# Altium project TS-IC EMC1833T.PrjPcb
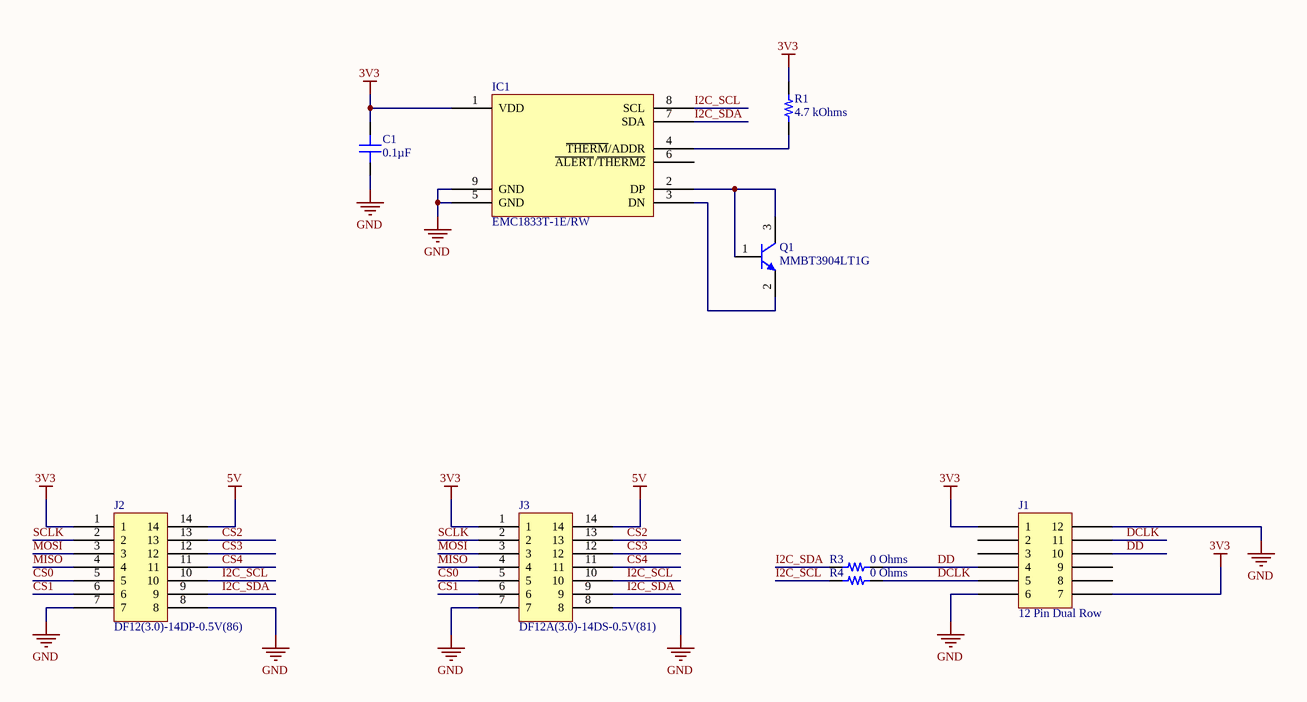
[diagram p0: EMC1833T.SchDoc]
1 sheet, 9 parts. Net scope: global (net labels, ports and power ports of the same name join across sheets).
Board file: EM1833T Card.PcbDoc

## Sheet EMC1833T.SchDoc: Digital Temperature Sensor
size A4

### Parts
C1  0.1µF  [CAP 0603_1608]
IC1  EMC1833T-1E/RW  [MICROCHIP WDFN-8 2x2MM]
J1  12 Pin Dual Row  [TE 5650118-3 Card Edge]
J2  DF12(3.0)-14DP-0.5V(86)  [HIROSE DF12 3.0-14DP-0.5V 86]
J3  DF12A(3.0)-14DS-0.5V(81)  [HIROSE DF12A 3.0-14DS-0.5V 81]
Q1  MMBT3904LT1G  [ON SEMI SOT-23-3]
R1  4.7 kOhms  [RES 0603_1608]
R3  0 Ohms  [RES 0603_1608]
R4  0 Ohms  [RES 0603_1608]

### Nets
3V3: C1.1 IC1.1(VDD) J1.1 J1.7 J2.1 J3.1 R1.2
5V: J2.14 J3.14
GND: C1.2 IC1.5(GND) IC1.9(GND) J1.6 J1.12 J2.7 J2.8 J3.7 J3.8
CS0: J2.5 J3.5
CS1: J2.6 J3.6
CS2: J2.13 J3.13
CS3: J2.12 J3.12
CS4: J2.11 J3.11
DCLK: J1.5 J1.11 R4.2
DD: J1.4 J1.10 R3.2
I2C_SCL: IC1.8(SCL) J2.10 J3.10 R4.1
I2C_SDA: IC1.7(SDA) J2.9 J3.9 R3.1
MISO: J2.4 J3.4
MOSI: J2.3 J3.3
SCLK: J2.2 J3.2
NetIC1_2: IC1.2(DP) Q1.1(B) Q1.3(C)
NetIC1_3: IC1.3(DN) Q1.2(E)
NetIC1_4: IC1.4(~{THERM}/ADDR) R1.1

Not connected (* = marked no-connect by the designer): IC1 6(~{ALERT}/~{THERM2}); J1 2 3 8 9

### Notes on the sheet
- Title
- Size:
- Date:
- A4
- Number:
- Time:
- Revision:
- Sheet
- of
- File:

### Library data of the parts
C1 = CC0603ZRY5V7BB104: CAP CER 0.1UF 16V Y5V 0603; Manufacturer: Yageo; Temperature Coefficient: Y5V (F); Tolerance: -20%, +80%; Part Number: CC0603ZRY5V7BB104; Value: 0.1µF; Applications: General Purpose; Capacitance: 0.1µF; ComponentLink1Description: Datasheet; ComponentLink1URL: http://www.yageo.com/documents/recent/UPY-GPHC_Y5V_6.3V-to-50V_8.pdf; ComponentLink2Description: DigiKey Link; ComponentLink2URL: http://digikey.com/product-detail/en/yageo/CC0603ZRY5V7BB104/311-1369-1-ND/2103153; Device Package: 0603 (1608 Metric); LastUpdated: 21/01/2020 00:01:38; Lifecycle Status: Active; Minimum Order: 1; Mounting Type: Surface Mount, MLCC; Operating Temperature: -30°C ~ 85°C; Package / Case: 0603 (1608 Metric); Packaging: TapeAndReel; PartId: 17881; Part Status: Active; Price: 0.01; Series: CC; Size / Dimension: 0.063" L x 0.031" W (1.60mm x 0.80mm); Supplier 1: DigiKey; Supplier Part Number 1: 311-1369-1-ND; Thickness (Max): 0.035" (0.90mm); Voltage - Rated: 16V
IC1 = EMC1833T-1E/RW: 1.8V 3 CHANNEL TEMP SENSOR I2C 2; Manufacturer: Microchip Technology; Accuracy - Highest (Lowest): ±1.5°C; Output Type: I²C/SMBus; Sensing Temperature - Remote: -40°C ~ 125°C; Sensor Type: Digital, Remote; Voltage - Supply: 1.62V ~ 3.6V; Part Number: EMC1833T-1E/RW; ComponentLink1Description: Datasheet; ComponentLink1URL: http://www.microchip.com/mymicrochip/filehandler.aspx?ddocname=en607782; ComponentLink2Description: DigiKey Link; ComponentLink2URL: http://digikey.com/product-detail/en/microchip-technology/EMC1833T-1E-RW/EMC1833T-1E-RWCT-ND/9657607; Device Package: 8-WDFN Exposed Pad; Features: One-Shot, Programmable Limit, Standby Mode; LastUpdated: 25/05/2020 18:02:53; Lifecycle Status: Active; Minimum Order: 1; Mounting Type: Surface Mount; Operating Temperature: -40°C ~ 125°C; Package / Case: 8-WDFN Exposed Pad; Packaging: TapeAndReel; Part Status: Active; Price: 0.65; Series: -; Supplier 1: DigiKey; Supplier Part Number 1: EMC1833T-1E/RWCT-ND; Supplier Device Package: 8-WDFN (2x2); Test Condition: -40°C ~ 125°C
J2 = DF12(3.0)-14DP-0.5V(86): CONN HDR 14POS SMD GOLD; Manufacturer: Hirose Electric Co Ltd; Connector Type: Header, Outer Shroud Contacts; Mated Stacking Heights: 3mm; Number of Positions: 14; Pitch: 0.020" (0.50mm); Part Number: DF12(3.0)-14DP-0.5V(86); ComponentLink1Description: Datasheet; ComponentLink1URL: https://www.hirose.com/product/download/?distributor=digikey&type=specSheet&lang=en&num=DF12(3.0)-14DP-0.5V(86); ComponentLink2Description: DigiKey Link; ComponentLink2URL: http://digikey.com/product-detail/en/hirose-electric-co-ltd/DF12-3.0-14DP-0.5V-86/H11701CT-ND/2172493; Contact Finish: Gold; Contact Finish Thickness: 8.00µin (0.203µm); Features: Board Guide, Solder Retention; Height Above Board: 0.091" (2.30mm); LastUpdated: 06/08/2020 22:47:47; Lifecycle Status: Active; Minimum Order: 1; Mounting Type: Surface Mount; Number of Rows: 2; Packaging: TapeAndReel; Part Status: Active; Price: 0.38; Series: DF12; Supplier 1: DigiKey; Supplier Part Number 1: H11701CT-ND
J3 = DF12A(3.0)-14DS-0.5V(81): CONN RCPT 14POS SMD GOLD; Manufacturer: Hirose Electric Co Ltd; Connector Type: Receptacle, Center Strip Contacts; Mated Stacking Heights: 3mm; Number of Positions: 14; Pitch: 0.020" (0.50mm); Part Number: DF12A(3.0)-14DS-0.5V(81); ComponentLink1Description: Datasheet; ComponentLink1URL: https://www.hirose.com/product/document?clcode=CL0537-0721-0-86&productname=DF12(3.0)-10DP-0.5V(86)&series=DF12&documenttype=Catalog&lang=en&documentid=D31693_en; ComponentLink2Description: DigiKey Link; ComponentLink2URL: http://digikey.com/product-detail/en/hirose-electric-co-ltd/DF12A-3.0-14DS-0.5V-81/H11713CT-ND/2172505; Contact Finish: Gold; Contact Finish Thickness: 8.00µin (0.203µm); Features: Board Guide; Height Above Board: 0.087" (2.20mm); LastUpdated: 06/08/2020 22:48:47; Lifecycle Status: Active; Minimum Order: 1; Mounting Type: Surface Mount; Number of Rows: 2; Packaging: TapeAndReel; Part Status: Active; Price: 0.36; Series: DF12; Supplier 1: DigiKey; Supplier Part Number 1: H11713CT-ND
Q1 = MMBT3904LT1G: TRANS NPN 40V 0.2A SOT23; Manufacturer: ON Semiconductor; Current - Collector (Ic) (Max): 200mA; DC Current Gain (hFE) (Min) @ Ic, Vce: 100 @ 10mA, 1V; Frequency - Transition: 300MHz; Power - Max: 300mW; Vce Saturation (Max) @ Ib, Ic: 300mV @ 5mA, 50mA; Part Number: MMBT3904LT1G; ComponentLink1Description: Datasheet; ComponentLink1URL: http://www.onsemi.com/pub/Collateral/MMBT3904LT1-D.PDF; ComponentLink2Description: DigiKey Link; ComponentLink2URL: http://digikey.com/product-detail/en/on-semiconductor/MMBT3904LT1G/MMBT3904LT1GOSCT-ND/1139813; LastUpdated: 02/09/2020 01:30:08; Lifecycle Status: Active; Minimum Order: 1; Mounting Type: Surface Mount; Operating Temperature: -55°C ~ 150°C (TJ); Package / Case: TO-236-3, SC-59, SOT-23-3; Packaging: TapeAndReel; PartId: 168; Part Status: Active; Price: 0.02; Series: -; Supplier 1: DigiKey; Supplier Part Number 1: MMBT3904LT1GOSCT-ND; Supplier Device Package: SOT-23-3 (TO-236); Transistor Type: NPN; Voltage - Collector Emitter Breakdown (Max): 40V
R1 = ERJ-3EKF4701V: RES SMD 4.7K OHM 1% 1/10W 0603; Manufacturer: Panasonic Electronic Components; Power (Watts): 0.1W, 1/10W; Temperature Coefficient: ±100ppm/°C; Part Number: ERJ-3EKF4701V; Value: 4.7 kOhms; ComponentLink1Description: Datasheet; ComponentLink1URL: https://industrial.panasonic.com/cdbs/www-data/pdf/RDA0000/AOA0000C304.pdf; ComponentLink2Description: DigiKey Link; ComponentLink2URL: http://digikey.com/product-detail/en/panasonic-electronic-components/ERJ-3EKF4701V/P4.70KHCT-ND/1746782; Composition: Thick Film; Device Package: 0603 (1608 Metric); Features: Automotive AEC-Q200; Height - Seated (Max): 0.022" (0.55mm); LastUpdated: 02/09/2020 01:10:23; Lifecycle Status: Active; Minimum Order: 1; Number of Terminations: 2; Operating Temperature: -55°C ~ 155°C; Package / Case: 0603 (1608 Metric); Packaging: TapeAndReel; PartId: 5645; Part Status: Active; Price: 0.01; Ratings: AEC-Q200; Resistance: 4.7 kOhms; Series: ERJ; Size / Dimension: 0.063" L x 0.031" W (1.60mm x 0.80mm); Supplier 1: DigiKey; Supplier Part Number 1: P4.70KHCT-ND; Supplier Device Package: 0603; Tolerance: ±1%
R3 R4 = ERJ-3GEY0R00V: RES SMD 0 OHM JUMPER 1/10W 0603; Manufacturer: Panasonic Electronic Components; Power (Watts): 0.1W, 1/10W; Part Number: ERJ-3GEY0R00V; Value: 0 Ohms; ComponentLink1Description: Datasheet; ComponentLink1URL: http://industrial.panasonic.com/www-cgi/jvcr13pz.cgi?E+PZ+3+AOA0001+ERJ3GEY0R00V+7+WW; ComponentLink2Description: DigiKey Link; ComponentLink2URL: http://digikey.com/product-detail/en/panasonic-electronic-components/ERJ-3GEY0R00V/P0.0GCT-ND/134711; Composition: Thick Film; Device Package: 0603 (1608 Metric); Features: Automotive AEC-Q200; Height - Seated (Max): 0.022" (0.55mm); LastUpdated: 13/08/2020 10:36:40; Lifecycle Status: Active; Minimum Order: 1; Number of Terminations: 2; Operating Temperature: -55°C ~ 155°C; Package / Case: 0603 (1608 Metric); Packaging: CutTape; PartId: 22603; Part Status: Active; Price: 0.10; Ratings: AEC-Q200; Resistance: 0 Ohms; Series: ERJ; Size / Dimension: 0.063" L x 0.031" W (1.60mm x 0.80mm); Supplier 1: DigiKey; Supplier Part Number 1: P0.0GCT-ND; Supplier Device Package: 0603; Tolerance: Jumper